# EasyEDA Pro project ServoDriver.epro

# Schematic ServoDriver
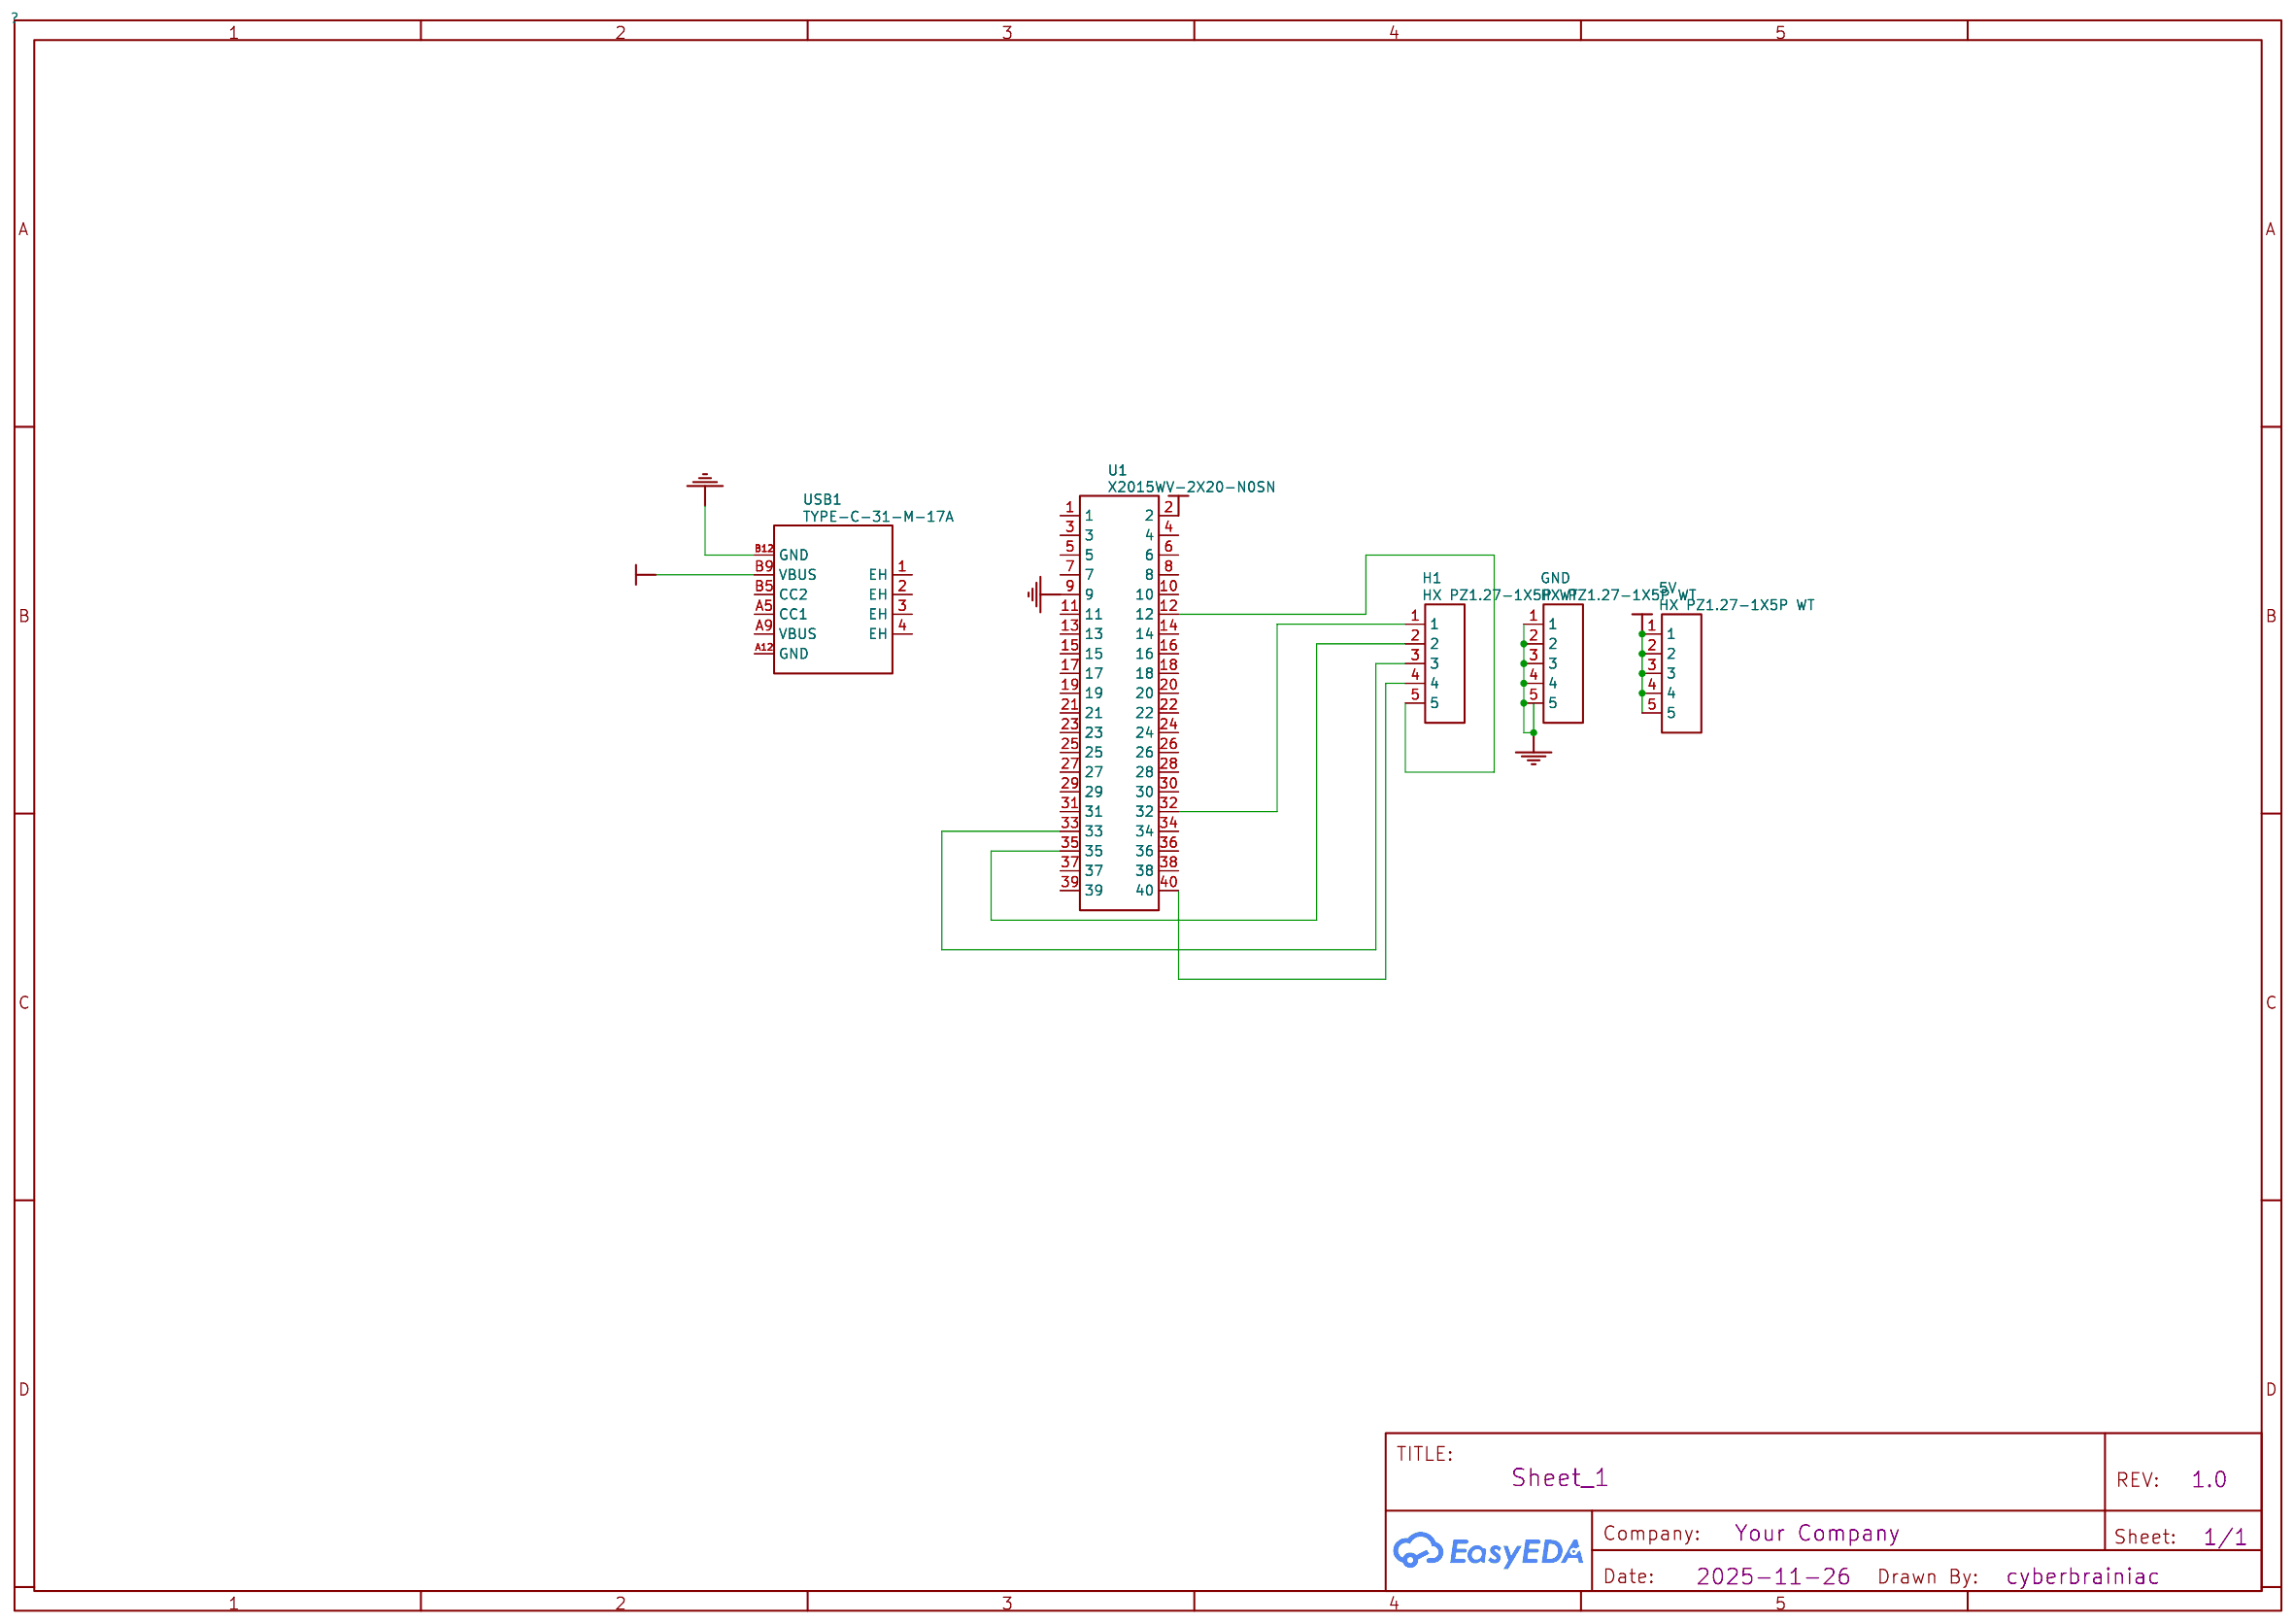
[diagram p0: schematic sheet]

## Parts
5V  HX PZ1.27-1X5P WT  [HDR-SMD_5P-P1.27-HX-PZ1.27-1X5P-WT]
GND  HX PZ1.27-1X5P WT  [HDR-SMD_5P-P1.27-HX-PZ1.27-1X5P-WT]
H1  HX PZ1.27-1X5P WT  [HDR-SMD_5P-P1.27-HX-PZ1.27-1X5P-WT]
U1  X2015WV-2X20-N0SN  [CONN-TH_X2015WV-2X20-N0SN]
USB1  TYPE-C-31-M-17A  [TYPE-C-SMD_TYPE-C-31-M-17A]

## Library data of the parts
5V GND H1 = HX PZ1.27-1X5P WT: Supplier: LCSC; Supplier Part: C46061655; Manufacturer: hanxia(韩下); Manufacturer Part: HX PZ1.27-1x5P WT; JLCPCB Part Class: Extended Part; Contributor: lcsc; spicePre: H
U1 = X2015WV-2X20-N0SN: Supplier: LCSC; Supplier Part: C2882181; Manufacturer: XKB Connection(中国星坤); Manufacturer Part: X2015WV-2x20-46SN; JLCPCB Part Class: Extended Part; Contributor: LCSC; spicePre: U
USB1 = TYPE-C-31-M-17A: Supplier: LCSC; Supplier Part: C22464426; Manufacturer: 韩国韩荣; JLCPCB Part Class: Extended Part; Contributor: lcsc; spicePre: U

## Nets
+5V: 5V.1 5V.2 5V.3 5V.4 5V.5 U1.2 USB1.B9(VBUS)
GND: GND.1 GND.2 GND.3 GND.4 GND.5 U1.9 USB1.B12(GND)
U1_12: H1.5 U1.12
U1_32: H1.1 U1.32
U1_33: H1.3 U1.33
U1_35: H1.2 U1.35
U1_40: H1.4 U1.40

Not connected (* = marked no-connect by the designer): U1 1 3 4 5 6 7 8 10 11 13 14 15 16 17 18 19 20 21 22 23 24 25 26 27 28 29 30 31 34 36 37 38 39; USB1 1(EH) 2(EH) 3(EH) 4(EH) A5(CC1) A9(VBUS) A12(GND) B5(CC2)

# Board 1-PCB_PCB_ServoDriver
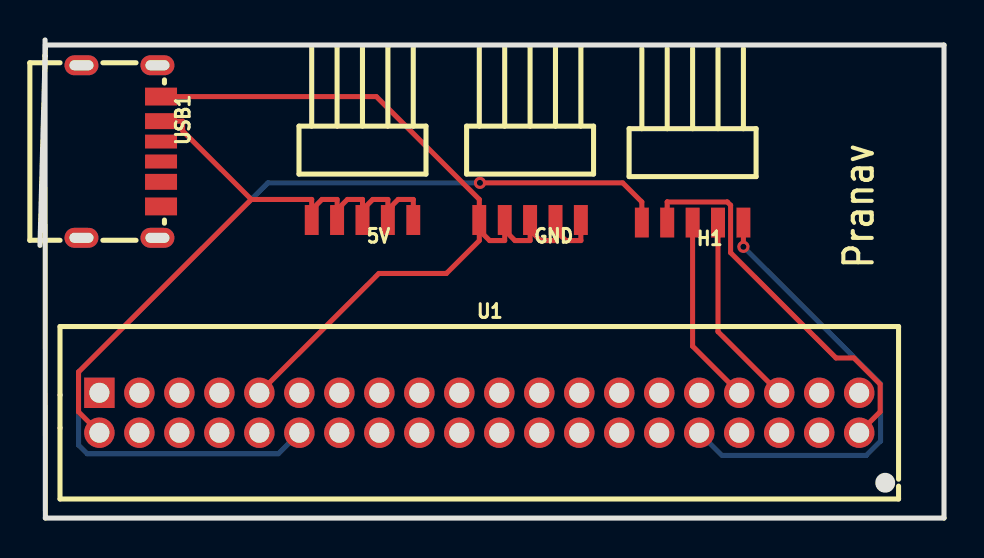
[diagram p1: board, top side]
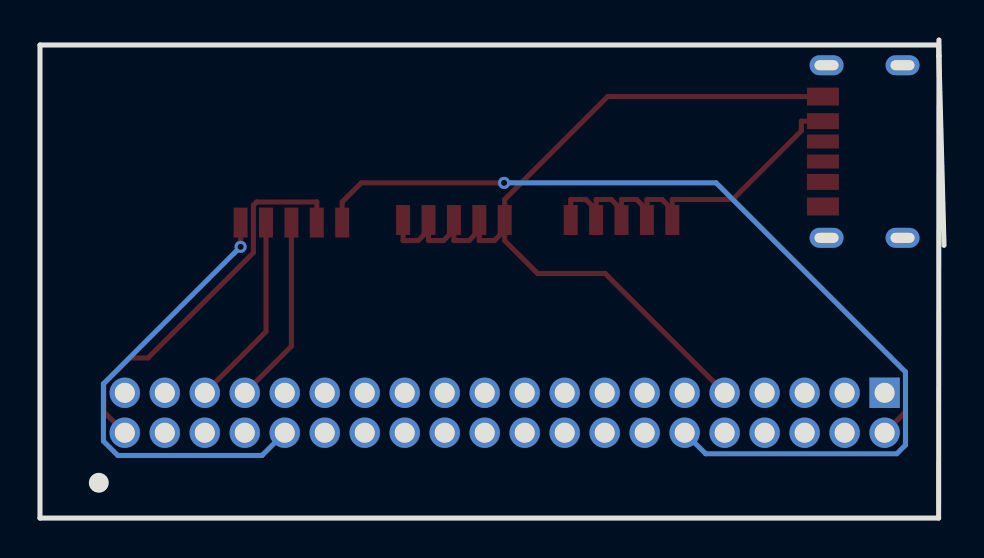
[diagram p2: board, bottom side, seen from below]

Outline 45.21 x 23.94 mm; copper layers: Top Layer, Bottom Layer. Coordinates in mm from the lower left corner of the outline.
Outline path: 0,13.66 0.25,23.14 ; 0.25,23.14 0.25,23.94 ; 0.25,23.14 0.27,23.69 45.21,23.69 45.21,0 0.27,0 0.25,23.14

## Design rules (mm)
via Default (default): diameter min 0.61, default 0.61, max 100.025; hole min 0.305, default 0.305, max 59.995

## Placement (name value [footprint] x y rotation side)
5V  HX PZ1.27-1X5P WT  [HDR-SMD_5P-P1.27-HX-PZ1.27-1X5P-WT]  16.13 14.92 180 top
GND  HX PZ1.27-1X5P WT  [HDR-SMD_5P-P1.27-HX-PZ1.27-1X5P-WT]  24.51 14.92 180 top
H1  HX PZ1.27-1X5P WT  [HDR-SMD_5P-P1.27-HX-PZ1.27-1X5P-WT]  32.64 14.8 180 top
U1  X2015WV-2X20-N0SN  [CONN-TH_X2015WV-2X20-N0SN]  21.97 5.27 0 top
USB1  TYPE-C-31-M-17A  [TYPE-C-SMD_TYPE-C-31-M-17A]  4.06 18.35 270 top

## Footprints (pads in the part's own frame, mm; a bottom-side part is the same pattern mirrored in y, then rotated)
CONN-TH_X2015WV-2X20-N0SN
  rect 1.524x1.524 hole 1: 1(-19,1)
  round 1.524 hole 1: 2(-19,-1) 3(-17,1) 4(-17,-1) 5(-15,1) 6(-15,-1) 7(-13,1) 8(-13,-1) 9(-11,1) 10(-11,-1) 11(-9,1) 12(-9,-1) 13(-7,1) 14(-7,-1) 15(-5,1) 16(-5,-1) 17(-3,1) 18(-3,-1) 19(-1,1) 20(-1,-1) 21(1,1) 22(1,-1) 23(3,1) 24(3,-1) 25(5,1) 26(5,-1) 27(7,1) 28(7,-1) 29(9,1) 30(9,-1) 31(11,1) 32(11,-1) 33(13,1) 34(13,-1) 35(15,1) 36(15,-1) 37(17,1) 38(17,-1) 39(19,1) 40(19,-1)
HDR-SMD_5P-P1.27-HX-PZ1.27-1X5P-WT
  rect 0.7x1.5 smd: 1(-2.54,0) 2(-1.27,0) 3(0,0) 4(1.27,0) 5(2.54,0)
TYPE-C-SMD_TYPE-C-31-M-17A
  oval 1x1.7 hole 0.5x1.2: 1(-4.32,1.81) 2(4.32,1.81) 3(-4.32,-1.99) 4(4.32,-1.99)
  rect 0.7x1.6 smd: A5(-0.5,1.99) B5(0.5,1.99)
  rect 0.8x1.6 smd: A9(1.52,1.99) B9(-1.52,1.99)
  rect 0.9x1.6 smd: A12(2.75,1.99) B12(-2.75,1.99)

## Nets
As in the schematic.

## Via types
v1: diameter 0.61, hole 0.305, Top Layer to Bottom Layer, 2 vias

## Routing (per net, layer and track width the routed paths; a pad name or vN(x,y) marks a point on that pad's centre or on a via; arc(x,y) is an arc through that point)
+5V: length 36.2
  Top Layer w0.254: 10.57,15.95 7.13,19.39 7.13,19.87 USB1.B9 ; 10.57,15.95 13.59,15.95 13.59,15.44 ; 10.57,15.95 1.93,7.32 1.93,5.32 U1.2 ; 14.86,15.44 14.86,15.95 14.1,15.95 13.59,15.44 ; 14.86,15.44 15.37,15.95 16.13,15.95 16.13,15.44 ; 14.86,15.44 5V.4 ; 5V.1 18.67,15.95 17.91,15.95 17.4,15.44 ; 17.4,15.44 17.4,15.95 16.64,15.95 16.13,15.44 ; 17.4,15.44 5V.2 ; 16.13,15.44 5V.3 ; 13.59,15.44 5V.5
GND: length 44.3
  Top Layer w0.254: 21.97,14.41 21.97,13.9 20.33,12.25 16.95,12.25 U1.9 ; 21.97,14.41 22.49,13.9 23.24,13.9 23.24,14.41 ; 21.97,14.41 GND.5 21.97,15.95 16.82,21.1 USB1.B12 ; 25.78,14.41 26.3,13.9 27.05,13.9 GND.1 ; 25.78,14.41 25.78,13.9 25.03,13.9 24.51,14.41 ; 25.78,14.41 GND.2 ; GND.3 24.51,14.41 ; 24.51,14.41 24.51,13.9 23.76,13.9 23.24,14.41 ; GND.4 23.24,14.41
U1_12: length 48.8
  Top Layer w0.254: H1.5 30.1,15.83 29.14,16.78 v1(22,16.78)
  Bottom Layer w0.254: v1(22,16.78) 11.4,16.78 1.93,7.32 1.93,3.65 2.36,3.22 11.92,3.22 U1.12
U1_32: length 23.6
  Top Layer w0.254: v1(35.18,13.58) H1.1
  Bottom Layer w0.254: U1.32 34.11,3.13 41.32,3.13 42.04,3.86 42.04,6.72 v1(35.18,13.58)
U1_33: length 9.5
  Top Layer w0.254: H1.3 32.64,8.61 U1.33
U1_35: length 9.8
  Top Layer w0.254: U1.35 33.91,9.33 H1.2
U1_40: length 19.7
  Top Layer w0.254: H1.4 31.37,15.83 34.38,15.83 34.54,15.66 34.54,13.29 39.81,8.02 40.7,8.02 42.02,6.71 42.02,5.32 U1.40

## Text on the board
Top Silkscreen Layer: Pranav
